# EAGLE design board_schem (EAGLE 9.6.2)
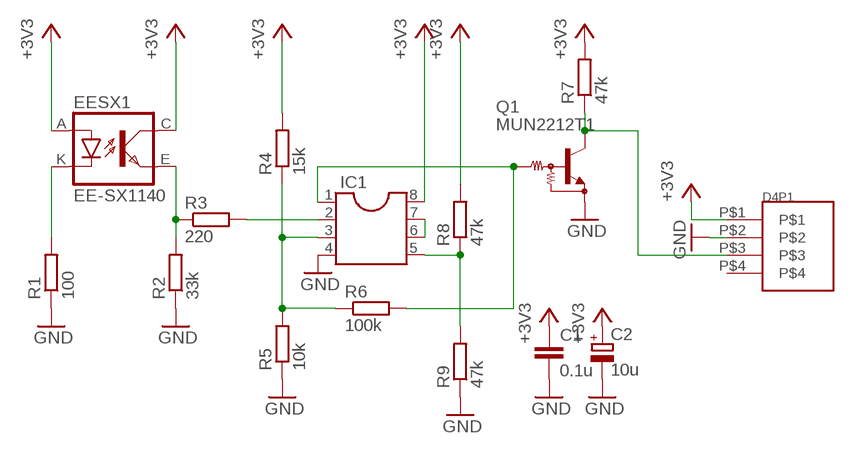
[diagram p0: schematic, sheet 1]

## Parts
C1  0.1u  C-EU050-024X044  [C050-024X044]
C2  10u  CPOL-EUE2.5-5  [E2,5-5]
D4P1  DF1E-4P  [DF1E-4P]
EESX1  EE-SX1140  [EE-SX1140]
IC1  DIL8  [DIL08]
Q1  MUN2212T1  [SC59-BEC]
R1  100  R-EU_0207/10  [0207/10]
R2  33k  R-EU_0207/10  [0207/10]
R3  220  R-EU_0207/10  [0207/10]
R4  15k  R-EU_0207/10  [0207/10]
R5  10k  R-EU_0207/10  [0207/10]
R6  100k  R-EU_0207/10  [0207/10]
R7  47k  R-EU_0207/10  [0207/10]
R8  47k  R-EU_0207/10  [0207/10]
R9  47k  R-EU_0207/10  [0207/10]

## Nets
+3V3 [3v3]: C1.1 C2.+ D4P1.P$1 EESX1.A EESX1.C(COL) IC1.8 R4.2 R7.2 R8.2
GND [gnd]: C1.2 C2.- D4P1.P$2 IC1.4 Q1.E R1.1 R2.1 R5.1 R9.1
N$1: EESX1.K(C) R1.2
N$2: EESX1.E(EMIT) R2.2 R3.1
N$3: IC1.2 R3.2
N$4: IC1.1 Q1.B R6.2
N$5: D4P1.P$3 Q1.C R7.1
N$6: IC1.3 R4.1 R5.2 R6.1
N$7: IC1.6 IC1.7
N$8: IC1.5 R8.1 R9.2
Unconnected: D4P1.P$4

## Library data of the parts
C1 = rcl:C-EU: CAPACITOR, European symbol; SPICEPREFIX: C
C2 = rcl:CPOL-EU: POLARIZED CAPACITOR, European symbol; SPICEPREFIX: C
D4P1 = lib_test:DF1E-4P
EESX1 = lib_test:EE-SX1140
IC1 = ic-package:DIL8: Dual In Line / Socket
Q1 = transistor-npn:MUN2212*: NPN Bias Resistor Transistor
R1-R9 = rcl:R-EU_: RESISTOR, European symbol; SPICEPREFIX: R

## Net classes
0 default: width 0.508 mm, clearance 0.508 mm
1 gnd: width 1.27 mm, clearance 0.508 mm
2 3v3: width 1.016 mm, clearance 0.508 mm

## Board
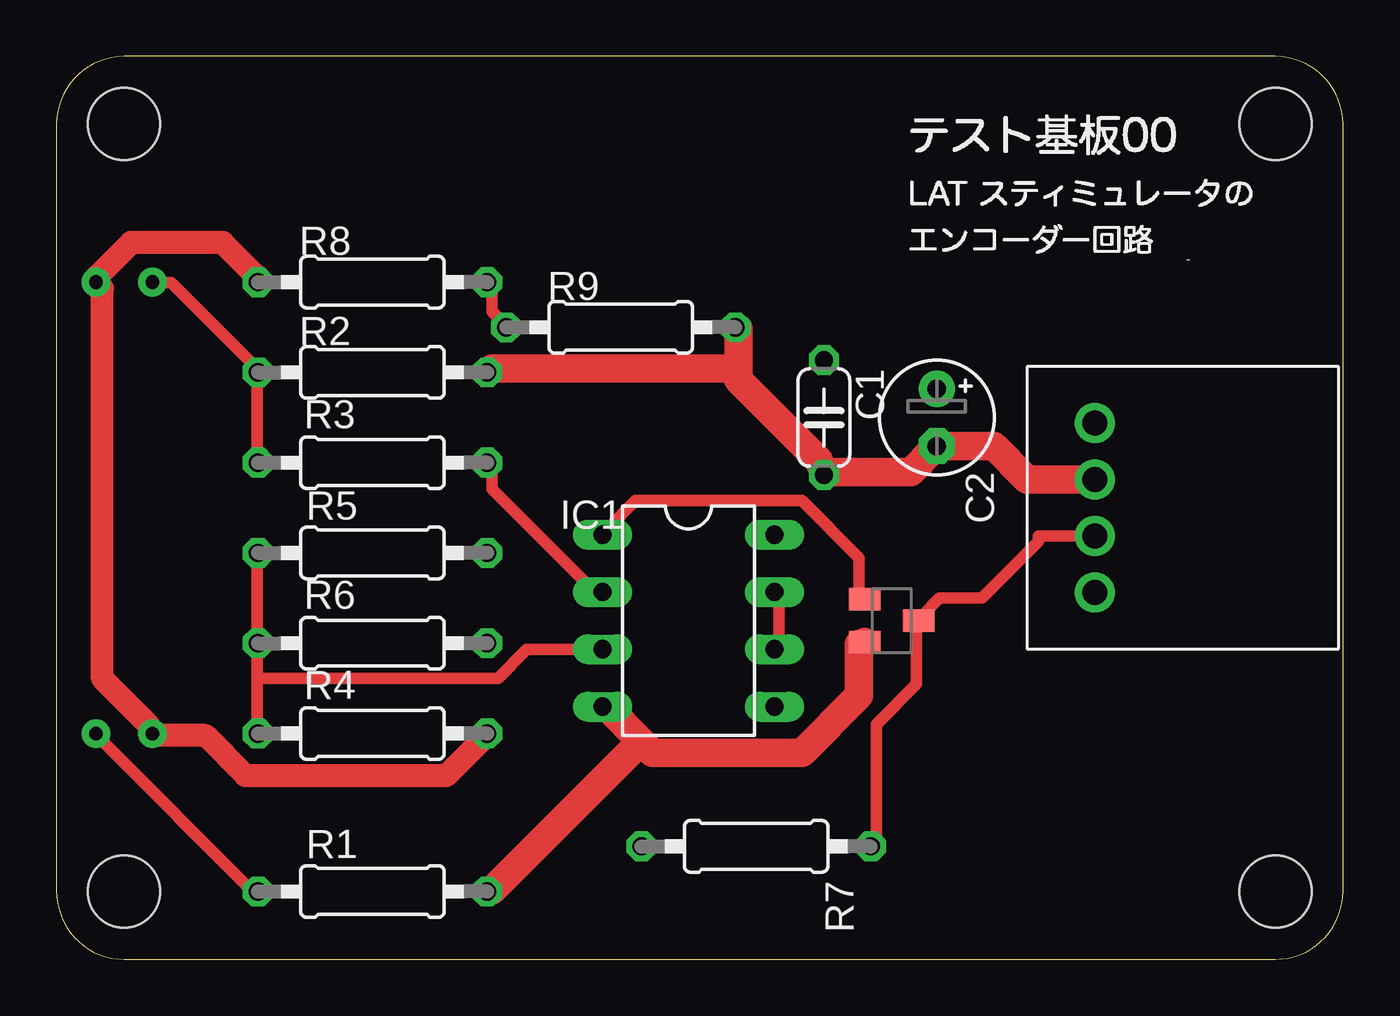
[diagram p1: board, top side]
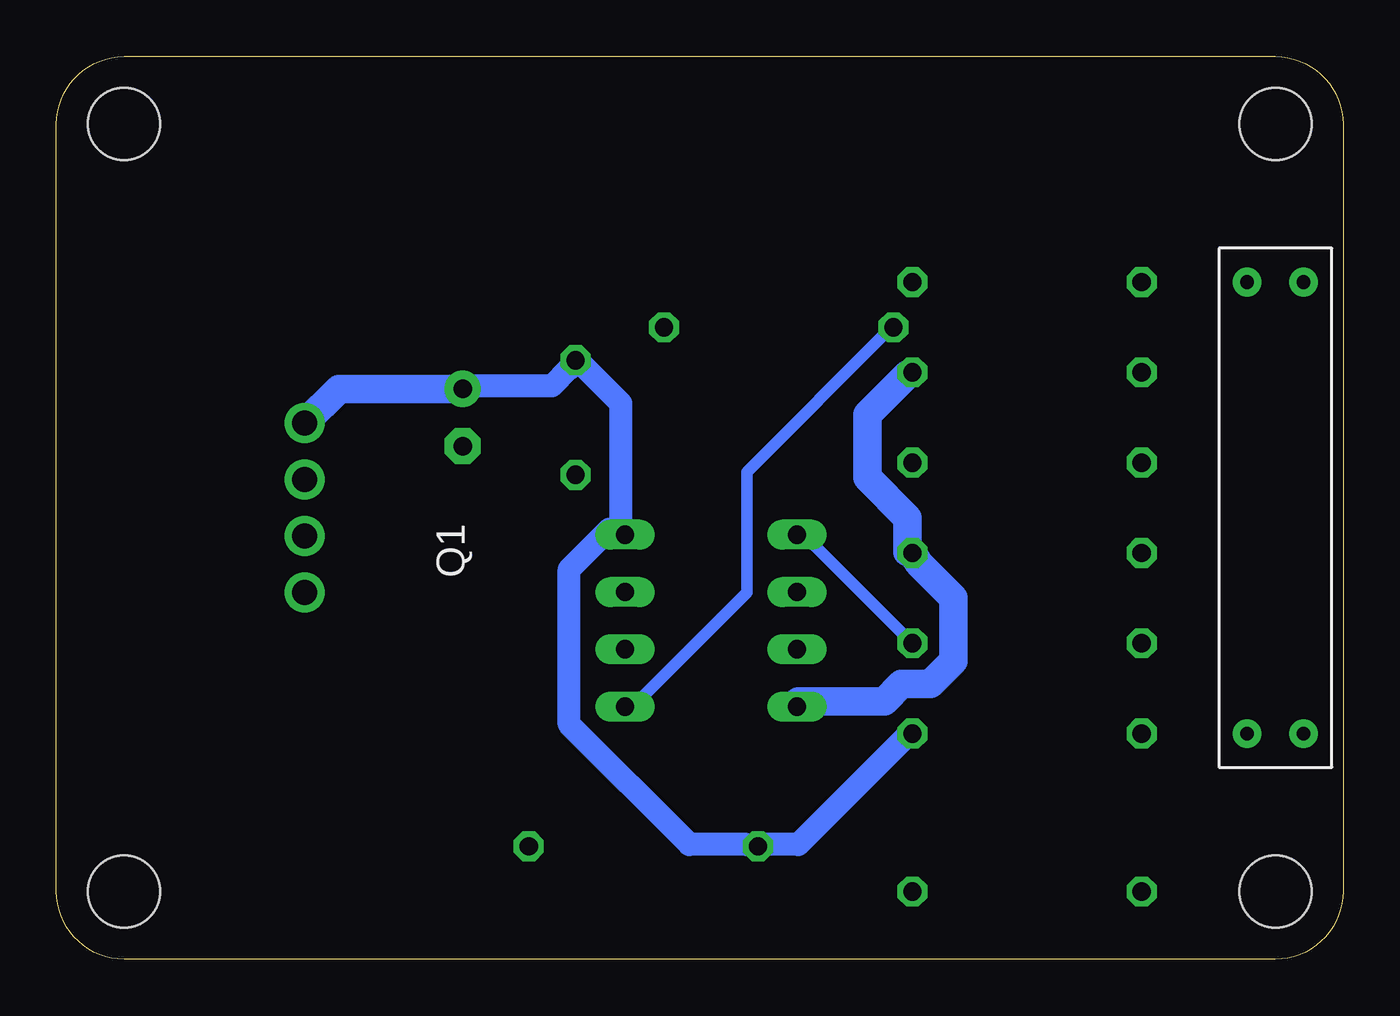
[diagram p2: board, bottom side, seen from below]

Size 57 x 40 mm. Coordinates in mm from the lower left corner, seen from the top.
Outline: 0,37 0,3 arc90 3,0 54,0 arc90 57,3 57,37 arc90 54,40 3,40 arc90 0,37
Copper layers (1*16): Top 0.035mm / dielectric 1.5mm / Bottom 0.035mm
Design rules "default": minimum track width 6mil, minimum drill 0.35mm, track to track 6mil, track to pad 6mil, pad to pad 6mil, via to via 6mil, smd to smd 6mil, copper to edge 40mil, drill to drill 6mil, minimum pad ring 10mil, minimum via ring 8mil, stop-mask expansion 4mil, vias tented up to drill 0mil, thermal gap 10mil
Holes 3.2 mm at 3,37 3,3 54,3 54,37

### Footprints (pad centres in the part's own frame; a part is rotated, then mirrored left to right if it is on the bottom)
C050-024X044 = drill 0.813 octagon: 1 -2.54,0; 2 2.54,0
E2,5-5 = drill 0.813 pad 1.6: + -1.27,0 | drill 0.813 pad 1.6 octagon: - 1.27,0
DF1E-4P = drill 1.1 pad 1.778: P$1 0,3.75; P$2 0,1.25; P$3 0,-1.25; P$4 0,-3.75
EE-SX1140 = drill 0.6 pad 1.27: A 1.25,10; C -1.25,-10; E 1.25,-10; K -1.25,10
DIL08 = drill 0.813 long: 1 -3.81,-3.81; 2 -1.27,-3.81; 3 1.27,-3.81; 4 3.81,-3.81; 5 3.81,3.81; 6 1.27,3.81; 7 -1.27,3.81; 8 -3.81,3.81
SC59-BEC = smd 1 x 1.4: B -0.95,-1.2; C 0,1.2; E 0.95,-1.2
0207/10 = drill 0.813 octagon: 1 -5.08,0; 2 5.08,0

### Placement (x,y rotation side)
C1  34,24 270 top
C2  39,24 270 top
D4P1  46,20 0 top
EESX1  3,20 180 bottom
IC1  28,15 270 top
Q1  37,15 270 top
R1  14,3 180 top
R2  14,26 180 top
R3  14,22 0 top
R4  14,10 0 top
R5  14,18 180 top
R6  14,14 0 top
R7  31,5 180 top
R8  14,30 180 top
R9  25,28 180 top

### Tracks (layer width: path | path; a pad name or v marks a point on that pad's centre or on a via)
+3V3
  Top 1.016: R8.2 8.89,30.23 7.37,31.75 3.3,31.75 1.78,30.23 EESX1.C 2.03,29.72 2.03,12.45 4.06,10.41 EESX1.A 4.32,9.91 6.6,9.91 8.38,8.13 17.27,8.13 19.05,9.91 R4.2
  Bottom 1.016: 39.37,25.15 C2.+ 38.86,25.4 35.05,25.4 34.29,26.16 C1.1 33.78,26.42 32,24.64 32,19.05 IC1.8 32.51,19.05 34.29,17.27 34.29,10.41 28.96,5.08 26.42,5.08 R7.2 25.91,5.08 24.13,5.08 19.3,9.91 R4.2
  Bottom 1.27: C2.+ 44.48,25.27 D4P1.P$1
GND
  Top 1.27: 25.91,9.65 24.38,11.18 IC1.4 | 25.91,9.65 26.42,9.14 33.02,9.14 35.56,11.68 35.56,13.97 Q1.E | 25.91,9.65 19.3,3.05 R1.1 | 30.23,26.16 30.23,25.65 33.78,22.1 C1.2 34.04,21.59 37.85,21.59 38.86,22.61 C2.- 41.52,22.73 43,21.25 D4P1.P$2 | 30.23,26.16 30.23,27.94 R9.1 | 30.23,26.16 19.3,26.16 R2.1
  Bottom 1.27: R2.1 19.3,25.91 21.08,24.13 21.08,21.34 19.3,19.56 19.3,18.03 R5.1 18.8,17.53 17.27,16 17.27,13.21 18.29,12.19 19.56,12.19 20.32,11.43 24.13,11.43 IC1.4
N$1
  Top 0.508: EESX1.K 1.78,9.91 8.89,2.79 R1.2
N$2
  Top 0.508: EESX1.E 4.32,29.97 5.08,29.97 8.89,26.16 R2.2 8.89,25.91 8.89,22.1 R3.1
N$3
  Top 0.508: R3.2 19.3,21.84 19.3,20.83 23.62,16.51 24.13,16.51 IC1.2
N$4
  Top 0.508: Q1.B 35.56,16 35.56,17.78 33.02,20.32 25.65,20.32 24.38,19.05 IC1.1
  Bottom 0.508: R6.2 24.13,19.05 IC1.1
N$5
  Top 0.508: R7.1 36.32,5.08 36.32,10.41 38.1,12.19 38.1,14.99 Q1.C 38.35,15.24 39.11,16 41,16 43.5,18.5 43.5,18.75 D4P1.P$3
N$6
  Top 0.508: 8.89,12.45 8.89,13.97 R6.1 8.89,14.22 8.89,17.78 R5.2 | 8.89,12.45 8.89,10.16 R4.1 | 8.89,12.45 19.56,12.45 20.83,13.72 24.13,13.72 IC1.3
N$7
  Top 0.508: IC1.6 32,13.97 32,16.26 IC1.7
N$8
  Top 0.508: R8.1 19.3,29.97 19.3,28.7 19.81,28.19 R9.2
  Bottom 0.508: IC1.5 31.75,11.43 31.24,11.43 26.42,16.26 26.42,21.59 20.07,27.94 R9.2